# EAGLE design SwitchBreakout (EAGLE 9.6.2)
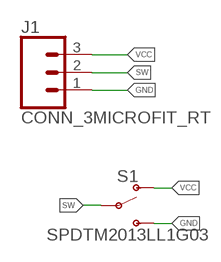
[diagram p0: schematic, sheet 1]

## Parts
J1  CONN_3MICROFIT_RT  [MICRO_FIT-1X3_RT]
S1  SPDTM2013LL1G03  [M2013LL1G03]

## Nets
GND: J1.1 S1.3(S)
SW: J1.2 S1.2(P)
VCC: J1.3 S1.1(O)

## Library data of the parts
J1 = bschulz:CONN_3: Genaric 3 terminal header Digikey 2.54_SCREW <https://www.digikey.com/product-detail/en/on-shore-technology-inc/OSTVN03A150/ED10562-ND/1588863> 3.5_SCREW <https://www.digikey.com/product-detail/en/on-shore-technology-inc/OSTTE030161/ED2636-ND/614585>; DIGIKEY: WM1861-ND; MF: Molex; MPN: 0436500300
S1 = bschulz:SPDT: Genaric SPDT switch; DIGIKEY: 360-2841-ND; MF: NKK; MPN: M2013LL1G03

## Board
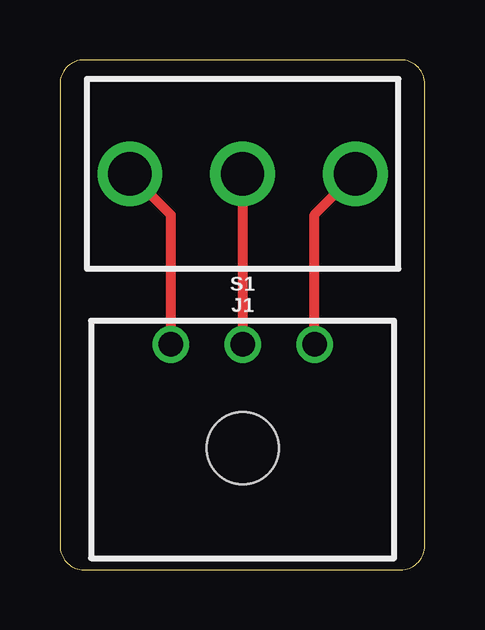
[diagram p1: board, top side]

Size 15.22 x 21.26 mm. Coordinates in mm from the lower left corner, seen from the top.
Outline: 0,20.26 0,1 arc90 1,0 14.22,0 arc90 15.22,1 15.22,20.26 arc90 14.22,21.26 1,21.26 arc90 0,20.26
Copper layers (1*16): Top 0.035mm / dielectric 1.5mm / Bottom 0.035mm
Design rules "default": minimum track width 6mil, minimum drill 0.35mm, track to track 6mil, track to pad 6mil, pad to pad 6mil, via to via 6mil, smd to smd 6mil, copper to edge 40mil, drill to drill 6mil, minimum pad ring 10mil, minimum via ring 8mil, stop-mask expansion 4mil, vias tented up to drill 0mil, thermal gap 10mil

### Footprints (pad centres in the part's own frame; a part is rotated, then mirrored left to right if it is on the bottom)
MICRO_FIT-1X3_RT = drill 1.02: 1 3,4.32; 2 0,4.32; 3 -3,4.32 | hole 3: 0,0
M2013LL1G03 = drill 1.8: 1 4.7,0; 2 0,0; 3 -4.7,0

### Placement (x,y rotation side)
J1  7.62,5.08 0 top
S1  7.62,16.51 180 top

### Tracks (layer width: path | path; a pad name or v marks a point on that pad's centre or on a via)
GND
  Top 0.406: J1.1 10.62,14.81 S1.3
SW
  Top 0.406: S1.2 J1.2
VCC
  Top 0.406: S1.1 4.62,14.81 J1.3

### Text on the board
bDocu: Toggle Switch Plug / v0.0 / Bobby Schulz / Break44